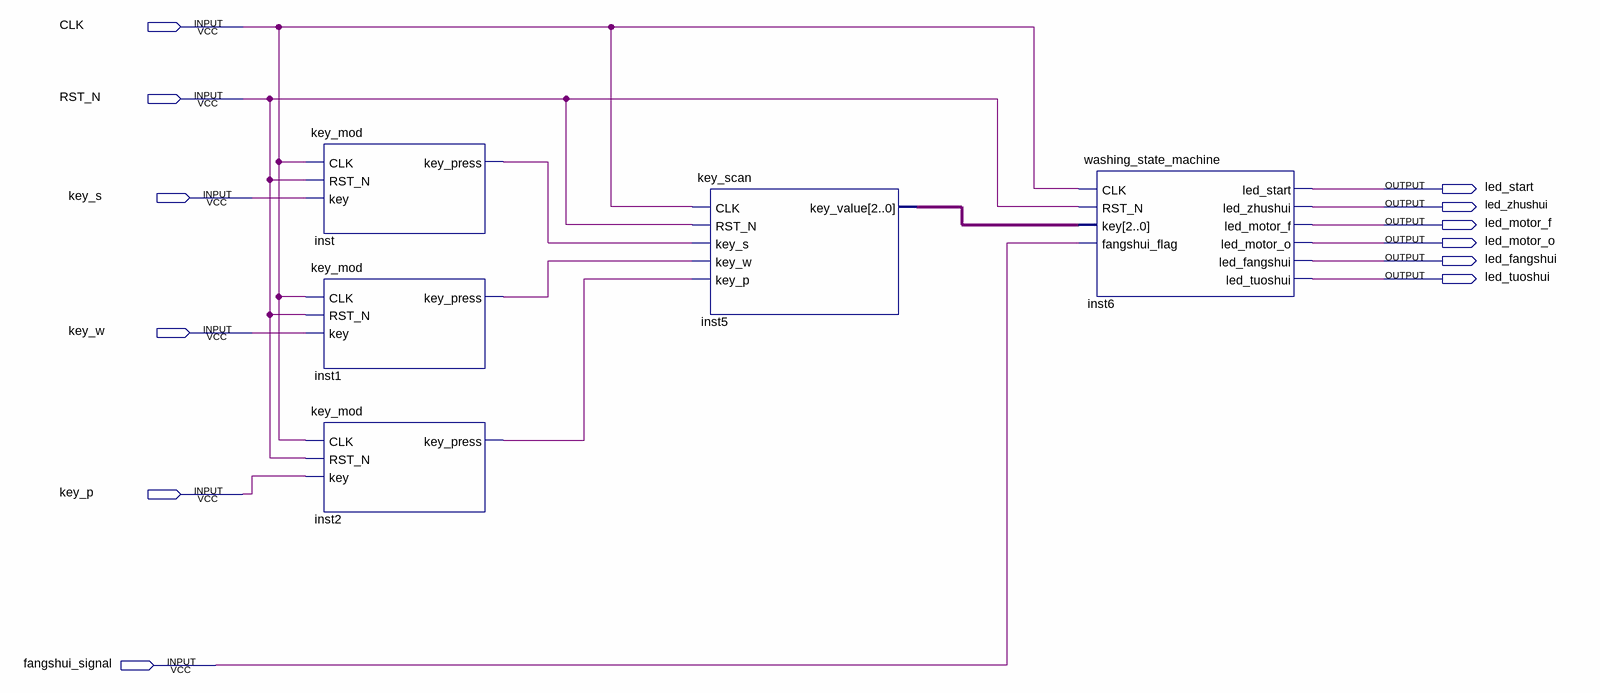
[diagram p0: schematic sheet]
// Quartus schematic washing_machine.bdf as structural Verilog: 5 symbols, 12 pins
module washing_machine (
  input  CLK,
  input  RST_N,
  input  key_s,
  input  key_w,
  input  key_p,
  input  fangshui_signal,
  output led_start,
  output led_zhushui,
  output led_motor_f,
  output led_motor_o,
  output led_fangshui,
  output led_tuoshui
);

  wire inst1_key_press, inst2_key_press, inst_key_press;
  wire [2:0] inst5_key_value;

  key_mod inst (.CLK(CLK), .RST_N(RST_N), .key(key_s), .key_press(inst_key_press));
  key_mod inst1 (.CLK(CLK), .RST_N(RST_N), .key(key_w), .key_press(inst1_key_press));
  key_mod inst2 (.CLK(CLK), .RST_N(RST_N), .key(key_p), .key_press(inst2_key_press));
  key_scan inst5 (
    .CLK(CLK), .RST_N(RST_N), .key_s(inst_key_press), .key_w(inst1_key_press), .key_p(inst2_key_press),
    .key_value(inst5_key_value));
  washing_state_machine inst6 (
    .CLK(CLK), .RST_N(RST_N), .key(inst5_key_value), .fangshui_flag(fangshui_signal), .led_start(led_start),
    .led_zhushui(led_zhushui), .led_motor_f(led_motor_f), .led_motor_o(led_motor_o),
    .led_fangshui(led_fangshui), .led_tuoshui(led_tuoshui));
endmodule
